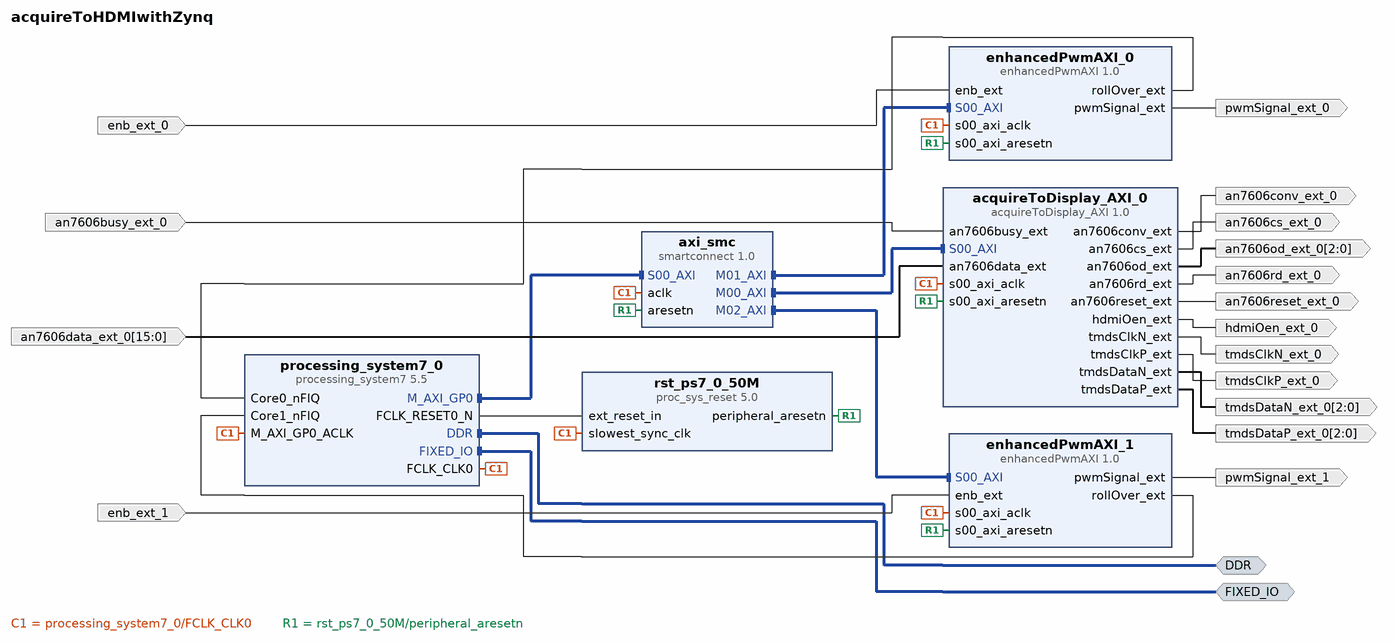
[diagram p0: block diagram of the top level]
# Vivado block design acquireToHDMIwithZynq, xc7z010clg400-1, Vivado 2025.1
create_bd_design acquireToHDMIwithZynq

create_bd_intf_port -mode Master -vlnv xilinx.com:interface:ddrx_rtl:1.0 DDR
create_bd_intf_port -mode Master -vlnv xilinx.com:display_processing_system7:fixedio_rtl:1.0 FIXED_IO
create_bd_port -dir I enb_ext_0
create_bd_port -dir O pwmSignal_ext_0
create_bd_port -dir O an7606conv_ext_0
create_bd_port -dir O an7606cs_ext_0
create_bd_port -dir O an7606rd_ext_0
create_bd_port -dir O an7606reset_ext_0
create_bd_port -dir O -from 2 -to 0 an7606od_ext_0
create_bd_port -dir O -from 2 -to 0 tmdsDataP_ext_0
create_bd_port -dir O -from 2 -to 0 tmdsDataN_ext_0
create_bd_port -dir O tmdsClkP_ext_0
create_bd_port -dir O tmdsClkN_ext_0
create_bd_port -dir O hdmiOen_ext_0
create_bd_port -dir I -from 15 -to 0 an7606data_ext_0
create_bd_port -dir I an7606busy_ext_0
create_bd_port -dir O pwmSignal_ext_1
create_bd_port -dir I enb_ext_1

create_bd_cell -type ip -vlnv xilinx.com:user:enhancedPwmAXI:1.0 enhancedPwmAXI_0
create_bd_cell -type ip -vlnv xilinx.com:user:acquireToDisplay_AXI:1.0 acquireToDisplay_AXI_0
create_bd_cell -type ip -vlnv xilinx.com:ip:processing_system7:5.5 processing_system7_0
set_property -dict [list \
  CONFIG.PCW_CORE0_FIQ_INTR 1 \
  CONFIG.PCW_CORE1_FIQ_INTR 1 \
  CONFIG.PCW_GPIO_MIO_GPIO_ENABLE 1 \
  CONFIG.PCW_GPIO_MIO_GPIO_IO MIO \
  CONFIG.PCW_I2C_RESET_ENABLE 0 \
  CONFIG.PCW_PRESET_BANK1_VOLTAGE {LVCMOS 1.8V} \
  CONFIG.PCW_TTC0_PERIPHERAL_ENABLE 1 \
  CONFIG.PCW_TTC0_TTC0_IO EMIO \
  CONFIG.PCW_UART1_PERIPHERAL_ENABLE 1 \
  CONFIG.PCW_UART1_UART1_IO {MIO 48 .. 49} \
  CONFIG.PCW_UART_PERIPHERAL_FREQMHZ 100 \
  CONFIG.PCW_UIPARAM_DDR_PARTNO {MT41J128M16 HA-125} \
  CONFIG.PCW_USB_RESET_ENABLE 0 \
  CONFIG.PCW_USE_FABRIC_INTERRUPT 1 \
] [get_bd_cells processing_system7_0]
# 194 more settings of processing_system7_0 are not shown: defaults, MIO pin electricals, DDR timing, and values the tool derives
create_bd_cell -type ip -vlnv xilinx.com:ip:smartconnect:1.0 axi_smc
set_property -dict {CONFIG.NUM_MI 3 CONFIG.NUM_SI 1} [get_bd_cells axi_smc]
create_bd_cell -type ip -vlnv xilinx.com:ip:proc_sys_reset:5.0 rst_ps7_0_50M
create_bd_cell -type ip -vlnv xilinx.com:user:enhancedPwmAXI:1.0 enhancedPwmAXI_1

# ---- connections ----

connect_bd_intf_net [get_bd_intf_pins axi_smc/M00_AXI] [get_bd_intf_pins acquireToDisplay_AXI_0/S00_AXI]
connect_bd_intf_net [get_bd_intf_pins axi_smc/M01_AXI] [get_bd_intf_pins enhancedPwmAXI_0/S00_AXI]
connect_bd_intf_net [get_bd_intf_pins axi_smc/M02_AXI] [get_bd_intf_pins enhancedPwmAXI_1/S00_AXI]
connect_bd_intf_net [get_bd_intf_ports DDR] [get_bd_intf_pins processing_system7_0/DDR]
connect_bd_intf_net [get_bd_intf_ports FIXED_IO] [get_bd_intf_pins processing_system7_0/FIXED_IO]
connect_bd_intf_net [get_bd_intf_pins processing_system7_0/M_AXI_GP0] [get_bd_intf_pins axi_smc/S00_AXI]
connect_bd_net [get_bd_pins acquireToDisplay_AXI_0/an7606conv_ext] [get_bd_ports an7606conv_ext_0]
connect_bd_net [get_bd_pins acquireToDisplay_AXI_0/an7606cs_ext] [get_bd_ports an7606cs_ext_0]
connect_bd_net [get_bd_pins acquireToDisplay_AXI_0/an7606od_ext] [get_bd_ports an7606od_ext_0]
connect_bd_net [get_bd_pins acquireToDisplay_AXI_0/an7606rd_ext] [get_bd_ports an7606rd_ext_0]
connect_bd_net [get_bd_pins acquireToDisplay_AXI_0/an7606reset_ext] [get_bd_ports an7606reset_ext_0]
connect_bd_net [get_bd_pins acquireToDisplay_AXI_0/hdmiOen_ext] [get_bd_ports hdmiOen_ext_0]
connect_bd_net [get_bd_pins acquireToDisplay_AXI_0/tmdsClkN_ext] [get_bd_ports tmdsClkN_ext_0]
connect_bd_net [get_bd_pins acquireToDisplay_AXI_0/tmdsClkP_ext] [get_bd_ports tmdsClkP_ext_0]
connect_bd_net [get_bd_pins acquireToDisplay_AXI_0/tmdsDataN_ext] [get_bd_ports tmdsDataN_ext_0]
connect_bd_net [get_bd_pins acquireToDisplay_AXI_0/tmdsDataP_ext] [get_bd_ports tmdsDataP_ext_0]
connect_bd_net -net an7606busy_ext_0_1 [get_bd_ports an7606busy_ext_0] [get_bd_pins acquireToDisplay_AXI_0/an7606busy_ext]
connect_bd_net -net an7606data_ext_0_1 [get_bd_ports an7606data_ext_0] [get_bd_pins acquireToDisplay_AXI_0/an7606data_ext]
connect_bd_net -net enb_ext_0_1 [get_bd_ports enb_ext_0] [get_bd_pins enhancedPwmAXI_0/enb_ext]
connect_bd_net -net enb_ext_1_1 [get_bd_ports enb_ext_1] [get_bd_pins enhancedPwmAXI_1/enb_ext]
connect_bd_net [get_bd_pins enhancedPwmAXI_0/pwmSignal_ext] [get_bd_ports pwmSignal_ext_0]
connect_bd_net [get_bd_pins enhancedPwmAXI_0/rollOver_ext] [get_bd_pins processing_system7_0/Core0_nFIQ]
connect_bd_net [get_bd_pins enhancedPwmAXI_1/pwmSignal_ext] [get_bd_ports pwmSignal_ext_1]
connect_bd_net [get_bd_pins enhancedPwmAXI_1/rollOver_ext] [get_bd_pins processing_system7_0/Core1_nFIQ]
connect_bd_net [get_bd_pins processing_system7_0/FCLK_CLK0] \
  [get_bd_pins processing_system7_0/M_AXI_GP0_ACLK] [get_bd_pins axi_smc/aclk] [get_bd_pins rst_ps7_0_50M/slowest_sync_clk] \
  [get_bd_pins enhancedPwmAXI_0/s00_axi_aclk] [get_bd_pins enhancedPwmAXI_1/s00_axi_aclk] \
  [get_bd_pins acquireToDisplay_AXI_0/s00_axi_aclk]
connect_bd_net [get_bd_pins processing_system7_0/FCLK_RESET0_N] [get_bd_pins rst_ps7_0_50M/ext_reset_in]
connect_bd_net [get_bd_pins rst_ps7_0_50M/peripheral_aresetn] \
  [get_bd_pins axi_smc/aresetn] [get_bd_pins enhancedPwmAXI_0/s00_axi_aresetn] [get_bd_pins enhancedPwmAXI_1/s00_axi_aresetn] \
  [get_bd_pins acquireToDisplay_AXI_0/s00_axi_aresetn]

# ---- address map ----
assign_bd_address -offset 0x43C00000 -range 64K -target_address_space [get_bd_addr_spaces processing_system7_0/Data] [get_bd_addr_segs acquireToDisplay_AXI_0/S00_AXI/S00_AXI_reg]
assign_bd_address -offset 0x43C10000 -range 64K -target_address_space [get_bd_addr_spaces processing_system7_0/Data] [get_bd_addr_segs enhancedPwmAXI_0/S00_AXI/S00_AXI_reg]
assign_bd_address -offset 0x43C20000 -range 64K -target_address_space [get_bd_addr_spaces processing_system7_0/Data] [get_bd_addr_segs enhancedPwmAXI_1/S00_AXI/S00_AXI_reg]

validate_bd_design
save_bd_design
